# EAGLE schematic magnetic-rotary-encoder (EAGLE 4.16)
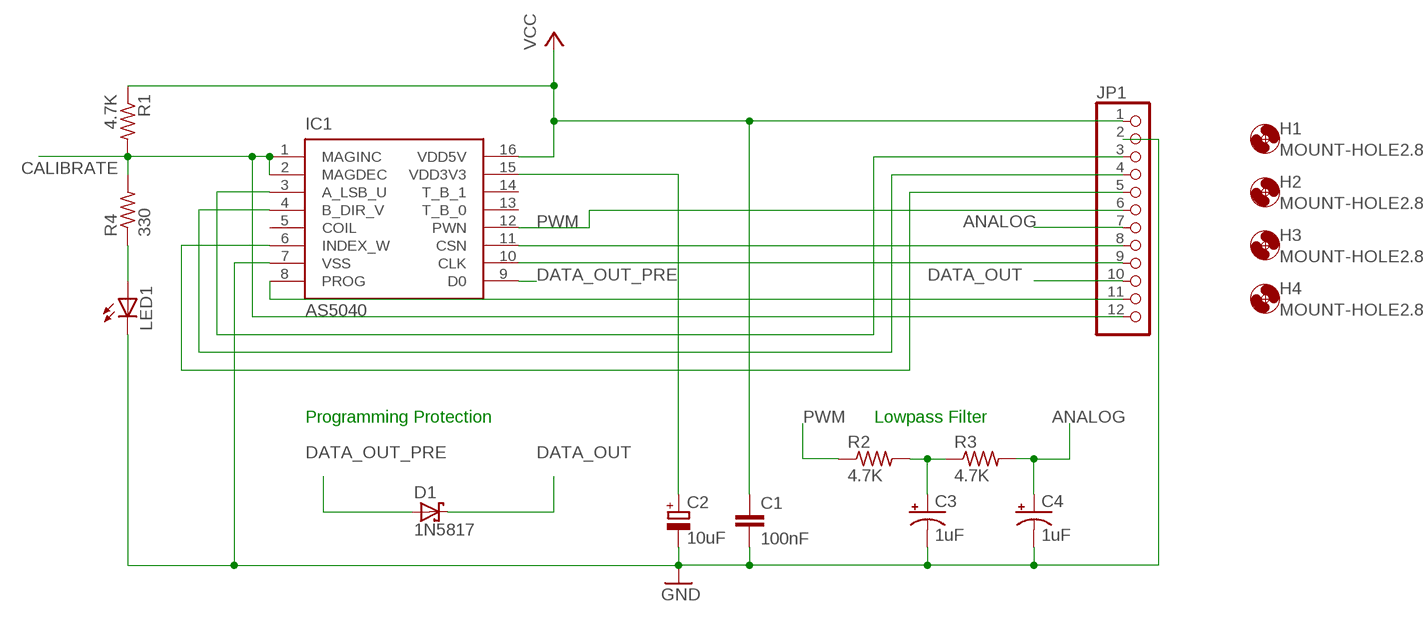
[diagram p0: schematic, sheet 1]

## Parts
C1  100nF  C-EU050-035X075  [C050-035X075]
C2  10uF  CPOL-EUE2-5  [E2-5]
C3  1uF  CPOL-USE2-5  [E2-5]
C4  1uF  CPOL-USE2-5  [E2-5]
D1  1N5817  SCHOTTKY-DIODEDO35-7  [DO35-7]
H1  MOUNT-HOLE2.8  [2,8]
H2  MOUNT-HOLE2.8  [2,8]
H3  MOUNT-HOLE2.8  [2,8]
H4  MOUNT-HOLE2.8  [2,8]
IC1  AS5040  [SSOP16]
JP1  PINHD-1X12  [1X12]
LED1  LED5MM  [LED5MM]
R1  4.7K  R-US_0207/7  [0207/7]
R2  4.7K  R-US_0207/7  [0207/7]
R3  4.7K  R-US_0207/7  [0207/7]
R4  330  R-US_0207/7  [0207/7]

## Nets
ANALOG: C4.+ JP1.7 R3.2
CALIBRATE: IC1.1(MAGINC) IC1.2(MAGDEC) JP1.12 R1.2 R4.2
DATA_OUT: D1.C JP1.10
DATA_OUT_PRE: D1.A IC1.9(D0)
GND: C1.2 C2.- C3.- C4.- IC1.7(VSS) JP1.2 LED1.K(C)
N$1: IC1.11(CSN) JP1.8
N$2: C3.+ R2.2 R3.1
N$3: IC1.3(A_LSB_U) JP1.3
N$4: IC1.4(B_DIR_V) JP1.4
N$5: IC1.6(INDEX_W) JP1.5
N$6: IC1.10(CLK) JP1.9
N$7: LED1.A R4.1
N$8: C2.+ IC1.15(VDD3V3)
N$9: IC1.8(PROG) JP1.11
PWM: IC1.12(PWN) JP1.6 R2.1
VCC: C1.1 IC1.16(VDD5V) JP1.1 R1.1
Unconnected: IC1.5(COIL) IC1.13(T_B_0) IC1.14(T_B_1)

## Notes on the sheet
- Programming Protection | Lowpass Filter

## Library data of the parts
C1 = rcl:C-EU: CAPACITOR, European symbol
C2 = rcl:CPOL-EU: POLARIZED CAPACITOR, European symbol
C3 C4 = rcl:CPOL-US: POLARIZED CAPACITOR, American symbol
D1 = diode:SCHOTTKY-DIODE: Schottky Diode
H1-H4 = holes:MOUNT-HOLE: MOUNTING HOLE with drill center marker
IC1 = austriamicrosystems:AS5040: 10-BIT PROGRAMMABLE MAGNETIC ROTARY ENCODER Source: www.austriamicrosystems.com .. AS5040DataSheetRev12.pdf
JP1 = pinhead:PINHD-1X12: PIN HEADER
LED1 = led:LED: LED OSRAM: - CHIPLED LG R971, LG N971, LY N971, LG Q971, LY Q971, LO R971, LY R971 LH N974, LH R974 LS Q976, LO Q976, LY Q976 LO Q996 - Hyper CHIPLED LW Q18S LB Q993, LB Q99A, LB R99A - SideLED LS A670, LO A670, LY A670, LG A670, LP A670 LB A673, LV A673, LT A673, LW A673 LH A674 LY A675 LS A676, LA A676, LO A676, LY A676, LW A676 LS A679, LY A679, LG A679 - Hyper Micro SIDELED® LS Y876, LA Y876, LO Y876, LY Y876 LT Y87S - SmartLED LW L88C, LW L88S LB L89C, LB L89S, LG L890 LS L89K, LO L89K, LY L89K LS L896, LA L896, LO L896, LY L896 - TOPLED LS T670, LO T670, LY T670, LG T670, LP T670 LSG T670, LSP T670, LSY T670, LOP T670, LYG T670 LG T671, LOG T671, LSG T671 LB T673, LV T673, LT T673, LW T673 LH T674 LS T676, LA T676, LO T676, LY T676, LB T676, LH T676, LSB T676, LW T676 LB T67C, LV T67C, LT T67C, LS T67K, LO T67K, LY T67K, LW E67C LS E67B, LA E67B, LO E67B, LY E67B, LB E67C, LV E67C, LT E67C LW T67C LS T679, LY T679, LG T679 LS T770, LO T770, LY T770, LG T770, LP T770 LB T773, LV T773, LT T773, LW T773 LH T774 LS E675, LA E675, LY E675, LS T675 LS T776, LA T776, LO T776, LY T776, LB T776 LHGB T686 LT T68C, LB T68C - Hyper Mini TOPLED® LB M676 - Mini TOPLED Santana® LG M470 LS M47K, LO M47K, LY M47K Source: http://www.osram.convergy.de - LUMILED® LXK2-PW12-R00, LXK2-PW12-S00, LXK2-PW14-U00, LXK2-PW14-V00 LXK2-PM12-R00, LXK2-PM12-S00, LXK2-PM14-U00 LXK2-PE12-Q00, LXK2-PE12-R00, LXK2-PE12-S00, LXK2-PE14-T00, LXK2-PE14-U00 LXK2-PB12-K00, LXK2-PB12-L00, LXK2-PB12-M00, LXK2-PB14-N00, LXK2-PB14-P00, LXK2-PB14-Q00 LXK2-PR12-L00, LXK2-PR12-M00, LXK2-PR14-Q00, LXK2-PR14-R00 LXK2-PD12-Q00, LXK2-PD12-R00, LXK2-PD12-S00 LXK2-PH12-R00, LXK2-PH12-S00 LXK2-PL12-P00, LXK2-PL12-Q00, LXK2-PL12-R00 Source: www.luxeon.com
R1-R4 = rcl:R-US_: RESISTOR, American symbol